# EAGLE schematic Frequency_Control (EAGLE 6.3)
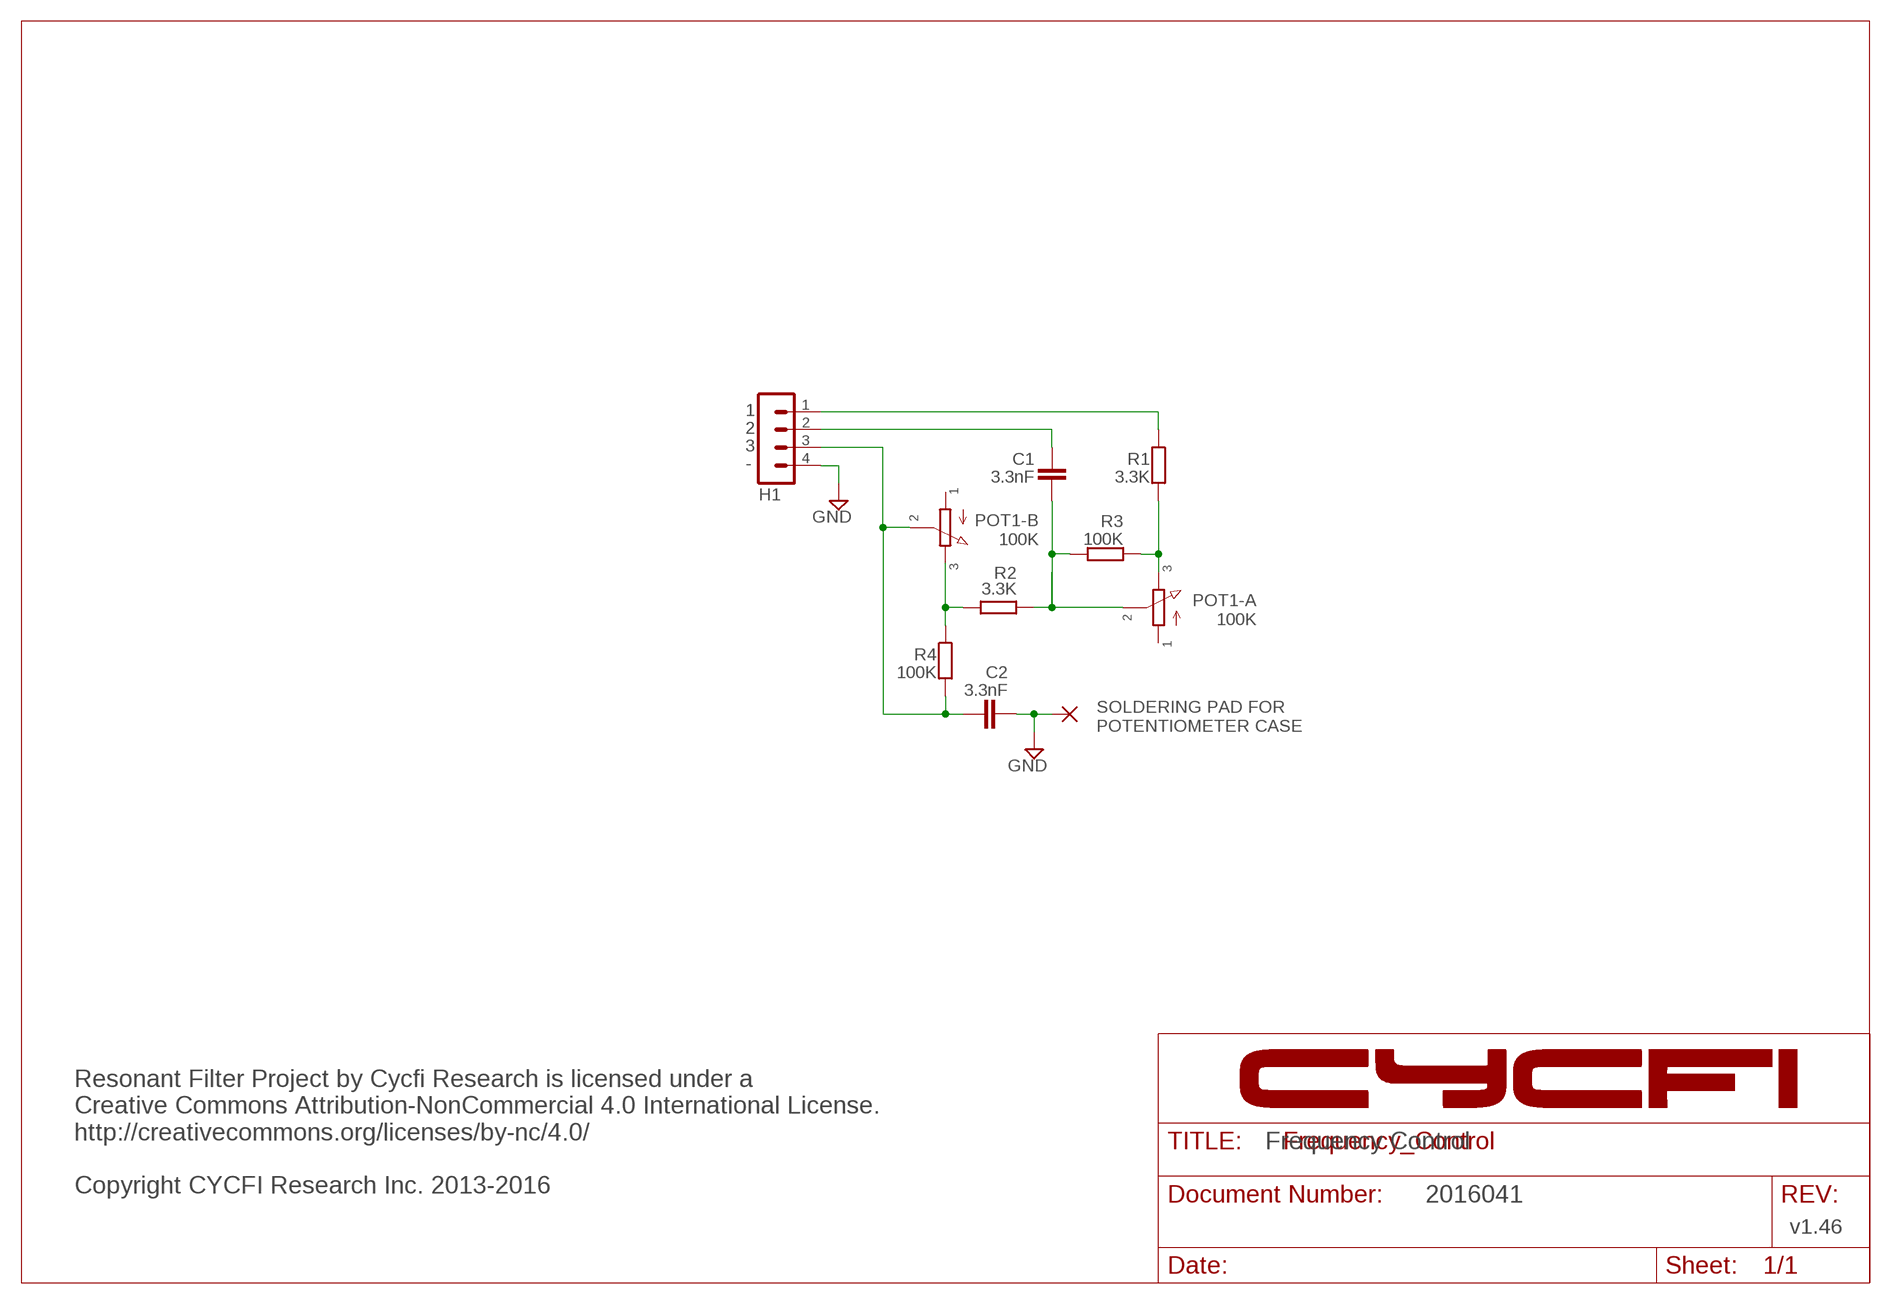
[diagram p0: schematic, sheet 1]

## Parts
C1  3.3nF  C-EUC0805  [C0805]
C2  3.3nF  C-EUC0805  [C0805]
H1  MA04-1  [MA04-1]
PAD1  1,6/0,9  [1,6/0,9]
POT1-A  PDB182-GTR02  [PDB182-GTR01]
R1  3.3K  R-EU_R0603  [R0603]
R2  3.3K  R-EU_R0603  [R0603]
R3  100K  R-EU_R0402  [R0402]
R4  100K  R-EU_R0402  [R0402]

## Nets
1: H1.1 R1.1
2: C1.2 H1.2
3: C2.1 H1.3 POT1-A.B2 R4.2
GND: C2.2 H1.4 PAD1.1(P)
N$1: POT1-A.A3 R1.2 R3.2
N$2: C1.1 POT1-A.A2 R2.1 R3.1
N$3: POT1-A.B3 R2.2 R4.1
Unconnected: POT1-A.A1 POT1-A.B1

## Notes on the sheet
- 1
- 2
- 3
- -
- POT1-B
  100K
- POT1-A
  100K
- SOLDERING PAD FOR 
  POTENTIOMETER CASE
- Frequency Control
- Resonant Filter Project by Cycfi Research is licensed under a 
  Creative Commons Attribution-NonCommercial 4.0 International License. 
  http://creativecommons.org/licenses/by-nc/4.0/
  
  Copyright CYCFI Research Inc. 2013-2016
- 2016041
- v1.46

## Library data of the parts
C1 C2 = resistor:C-EU: CAPACITOR, European symbol
H1 = con-lstb:MA04-1: PIN HEADER; OC_FARNELL: unknown; OC_NEWARK: unknown
PAD1 = wirepad:1,6/0,9: THROUGH-HOLE PAD
POT1-A = CYCFI_Passive:PDB182-GTR02
R1-R4 = resistor:R-EU_: RESISTOR, European symbol